# Altium schematic sheet 17.SchDoc
size 297 x 209 mm
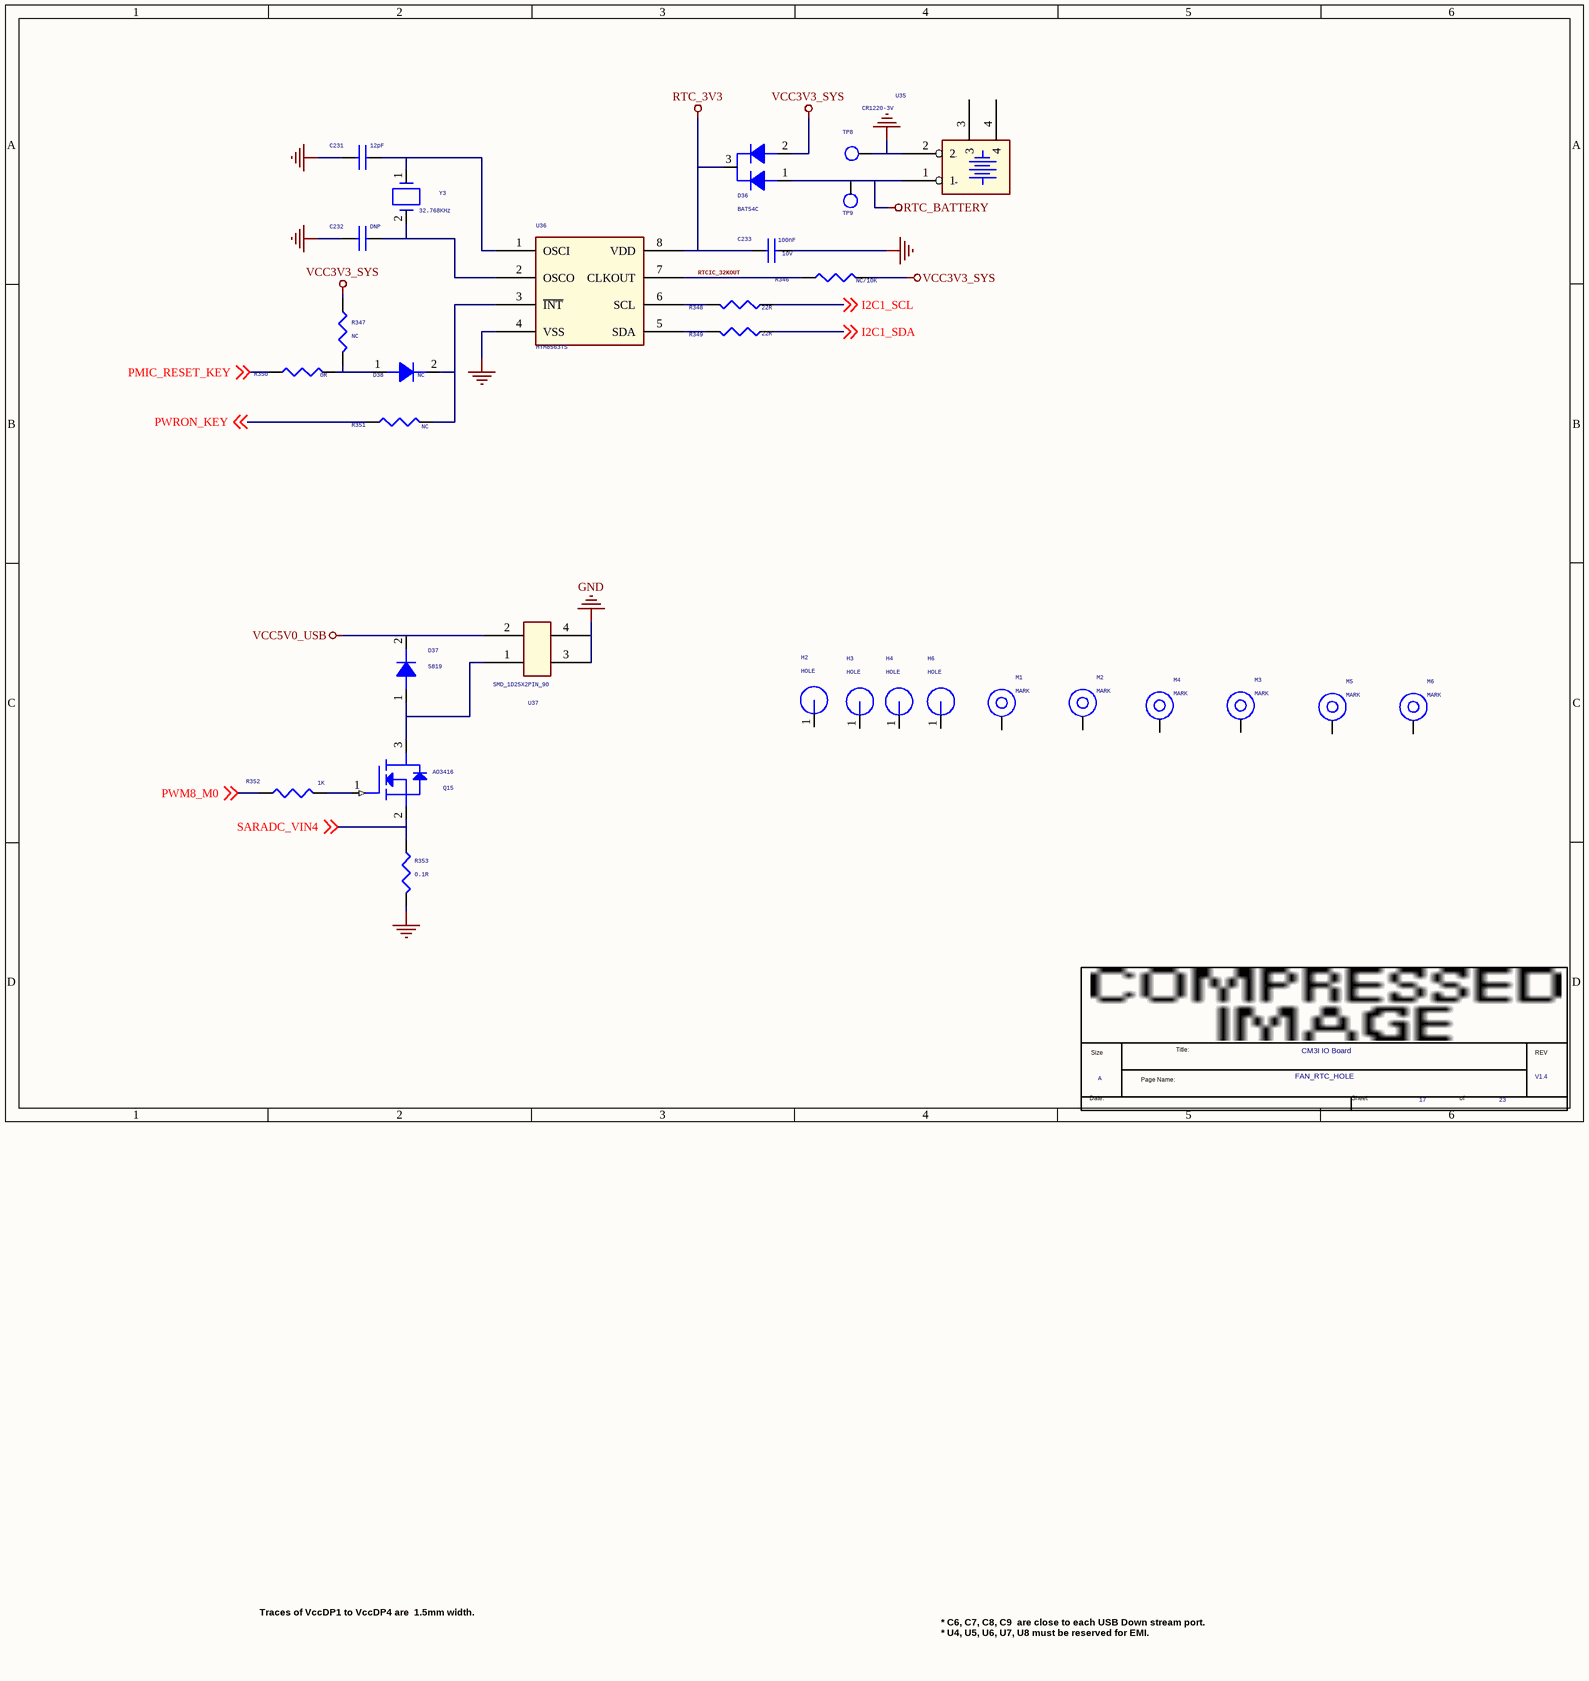
[diagram p0: 17.SchDoc]

## Parts
*  Page Count: 23  Page Number: 17  Page Size: A  Title: CM3I IO Board  RevCode: V1.4  Doc: FAN_RTC_HOLE  (hidden comment: radxa_1010)  (graphical)
C231  12pF  [C0402]
C232  DNP  [C0402]
C233  100nF  Voltage: 10V  [C0402]
D36  BAT54C  [SOT_23]
D37  5819  [SOD_123]
D38  NC  [SOD323]
H2  HOLE  [H3.8MM]
H3  HOLE  [H3.8MM]
H4  HOLE  [H3.8MM]
H6  HOLE  [H3.8MM]
M1  MARK  [MARK]
M2  MARK  [MARK]
M3  MARK  [MARK]
M4  MARK  [MARK]
M5  MARK  [MARK]
M6  MARK  [MARK]
Q15  AO3416  [SOT23]
R346  NC/10K  [R0402]
R347  NC  [R0402]
R348  22R  [R0402]
R349  22R  [R0402]
R350  0R  [R0402]
R351  NC  [R0402]
R352  1K  [R0402]
R353  0.1R  [R0402]
TP8  TP_0.7  [TEST]  (value not drawn)
TP9  TP_0.7  [TEST]  (value not drawn)
U35  CR1220-3V  [BATTERY-20MM]
U36  HYM8563TS  [MSOP8]
U37  SMD_1D25X2PIN_90  [SMD_1D25X2PIN_90]
Y3  32.768KHz  [CRY-3215]

## Nets
GND: C231.2 C232.2 C233.2 R353.2 TP8.1 U35.2 U36.4(VSS) U37.3 U37.4
RTC_3V3: C233.1 D36.3(K) U36.8(VDD)
RTC_BATTERY: D36.1(A1) TP9.1 U35.1
VCC3V3_SYS: D36.2(A2) R346.2 R347.1
VCC5V0_USB: D37.2(K) U37.2
I2C1_SCL: R348.1 ; off-sheet I2C1_SCL
I2C1_SDA: R349.1 ; off-sheet I2C1_SDA
PMIC_RESET_KEY: R350.1 ; off-sheet PMIC_RESET_KEY
PWM8_M0: R352.1 ; off-sheet PWM8_M0
PWRON_KEY: R351.1 ; off-sheet PWRON_KEY
RTCIC_32KOUT: R346.1 U36.7(CLKOUT)
SARADC_VIN4: Q15.2(SOURCE) R353.1 ; off-sheet SARADC_VIN4
NetC231_1: C231.1 U36.1(OSCI) Y3.1
NetC232_1: C232.1 U36.2(OSCO) Y3.2
NetD37_1: D37.1(A) Q15.3(DRAIN) U37.1
NetD38_1: D38.1(A) R347.2 R350.2
NetD38_2: D38.2(K) R351.2 U36.3(~{INT})
NetQ15_1: Q15.1(GATE) R352.2
NetR348_2: R348.2 U36.6(SCL)
NetR349_2: R349.2 U36.5(SDA)

Not connected (* = marked no-connect by the designer): H2 1; H3 1; H4 1; H6 1; M1 1; M2 1; M3 1; M4 1; M5 1; M6 1; U35 3 4

## Notes on the sheet
- Traces of VccDP1 to VccDP4 are  1.5mm width.
- * C6, C7, C8, C9  are close to each USB Down stream port.
  * U4, U5, U6, U7, U8 must be reserved for EMI.
- (in symbol CON_BATTERY-20MM_0) -; +
- (in symbol radxa_1010) Title:; Size; REV; Page Name:; Date:; Sheet; of

## Library data of the parts
C231 = CAP NP_0: cap,12.00pF,+/-5%,50V,C0G,C0402; Manufacturer PN: C1005C0G1H120J050BA; Manufacturer: TDK; Tolerance: 5%; Priority: A; Voltage: 50V; Dielectric: C0G; Created by: JJJ; Part Type: C0402; RK PN: C1005C0G1H120J050BA
C232 = CAP NP_0: Did Not Place.; Manufacturer PN: DNPC0402; Priority: A; Created by: JJJ; Part Type: DNP; RK PN: DNPC0402
C233 = CAP NP_0: cap,100.00nF,+/-10%,10V,X5R,C0402; Manufacturer: TDK; Number: 37; RK PN: C1005X5R1A104K050BA; Priority: A; Tolerance: 10%; C_Voltage: 6.3V; Dielectric: X5R; Part Type: C0402; Manufacturer PN: C1005X5R1A104K050BA; Created by: JJJ
D36 = DIODE Double: Dual Schottky barrier，BAT54C SOT-23 Schottky Barrier; Manufacturer: 长电; Priority: A; Created by: JJJ; Manufacturer PN: BAT54C; Part Type: Schottky rectifier; RK PN: BAT54C
D37 D38 = DIODE_Dup2: Schottky Barrier，B5819WS SOD-323; Manufacturer: 长电; Priority: A; Created by: JJJ; Manufacturer PN: B5819WS; Part Type: Schottky rectifier; RK PN: B5819WS
H2 H3 H6 = HOLE: 直径3.5mm hole; Priority: A; RK PN: HOLE_3R50; Created by: CZD; Part Type: HOLE
H4 = HOLE: 直径3.5mm hole; RK PN: HOLE_3R50; Priority: A; Part Type: HOLE; Created by: CZD
M1 M3 = MARK: MARK Symble; Priority: A; RK PN: MARK01; Created by: JJJ; Part Type: MARK
M2 M4-M6 = MARK: MARK Symble; RK PN: MARK01; Priority: A; Part Type: MARK; Created by: JJJ
Q15 = MOSFET N_Dup1: MOSFET-N,WNM3003 ,30V,+/-20V,4.0A,33m Ohm@Vgs=10V,43m Ohm@Vgs=4.5V,SOT23
R346 R347 R350 = RESISTOR_0_Dup1: 通用厚膜电阻,10K,+/-5%,R0402,1/16W.; Manufacturer PN: RC0402JR-0710KL; Manufacturer: YAGEO; Tolerance: 5%; option: DNP; Wattage: 1/16W; Priority: A; Created by: YTL; Part Type: 通用厚膜电阻; RK PN: RC0402JR-0710KL
R348 = RESISTOR_0_Dup1: 通用厚膜电阻,47K,+/-5%,R0402,1/16W.; Manufacturer: YAGEO; Tolerance: 5%; RK PN: RC0402JR-0747KL; Priority: A; Wattage: 1/16W; Part Type: 通用厚膜电阻; Manufacturer PN: RC0402JR-0747KL; Created by: YTL
R349 = RESISTOR_0_Dup1: 通用厚膜电阻,47K,+/-5%,R0402,1/16W.; Manufacturer PN: RC0402JR-0747KL; Manufacturer: YAGEO; Tolerance: 5%; Wattage: 1/16W; Priority: A; Created by: YTL; Part Type: 通用厚膜电阻; RK PN: RC0402JR-0747KL
R351 = RESISTOR_0_Dup1: 通用厚膜电阻,10K,+/-5%,R0402,1/16W.; Manufacturer: YAGEO; Tolerance: 5%; RK PN: RC0402JR-0710KL; Priority: A; Wattage: 1/16W; option: DNP; Part Type: 通用厚膜电阻; Manufacturer PN: RC0402JR-0710KL; Created by: YTL
R352 = RESISTOR_0_Dup1: 通用厚膜电阻,100K,+/-5%,R0402,1/16W.; Manufacturer: YAGEO; Tolerance: 5%; RK PN: RC0402JR-07100KL; Priority: A; Wattage: 1/16W; Part Type: 通用厚膜电阻; Manufacturer PN: RC0402JR-07100KL; Created by: YTL
R353 = RESISTOR_0_Dup1: 通用厚膜电阻,10K,+/-5%,R0402,1/16W.; Manufacturer PN: RC0402JR-0710KL; Manufacturer: YAGEO; Tolerance: 5%; Wattage: 1/16W; Priority: A; Created by: YTL; Part Type: 通用厚膜电阻; RK PN: RC0402JR-0710KL
TP8 = TP: Test Point 0.7mm; RK PN: TESTPOINT_0R7; Priority: A; Part Type: TP; Created by: JJJ
TP9 = TP: Test Point 0.7mm; Priority: A; RK PN: TESTPOINT_0R7; Created by: JJJ; Part Type: TP
U35 = CON_BATTERY-20MM_0
U36 = RTC_HYM8563: I2C Real Time Clock/Calendar; Manufacturer: Haoyu（昊昱微电子）; Priority: A; Created by: JJJ; Manufacturer PN: HYM8563TS; Part Type: RTC; RK PN: HYM8563TS
U37 = CON3_6
Y3 = CRYSTAL_2P_0: 无源晶振，32.768KHz，MC-146,±20ppm，12.5pF，Hosonic; Manufacturer: Hosonic(鸿星电子); RK PN: ETDE32.768W125BMPF; Priority: A; Part Type: CRYSTAL; Manufacturer PN: ETDE32.768W125BMPF; Created by: JJJ
* = radxa_1010: Page Create Date: March  8, 1995